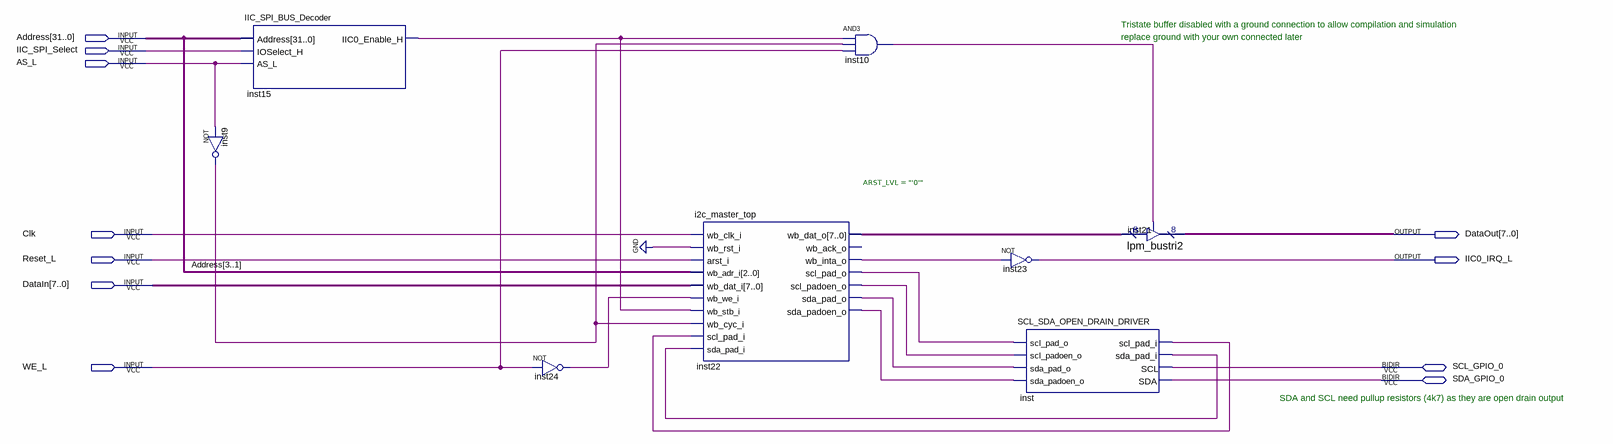
[diagram p0: schematic sheet]
// Quartus schematic IIC_SPI_Interface.bdf as structural Verilog: 8 symbols, 11 pins
module IIC_SPI_Interface (
  input  [31:0] Address,
  input  IIC_SPI_Select,
  input  AS_L,
  input  Clk,
  input  Reset_L,
  input  [7:0] DataIn,
  input  WE_L,
  inout  SCL_GPIO_0,
  inout  SDA_GPIO_0,
  output [7:0] DataOut,
  output IIC0_IRQ_L
);

  wire inst9_out, inst10_out, inst15_iic0_enable_h, inst22_scl_pad_o, inst22_scl_padoen_o, inst22_sda_pad_o,
       inst22_sda_padoen_o, inst22_wb_inta_o, inst24_out, inst_scl_pad_i, inst_sda_pad_i;
  wire [7:0] inst22_wb_dat_o;

  not inst9 (inst9_out, AS_L);
  IIC_SPI_BUS_Decoder inst15 (
    .Address(Address), .IOSelect_H(IIC_SPI_Select), .AS_L(AS_L), .IIC0_Enable_H(inst15_iic0_enable_h));
  not inst24 (inst24_out, WE_L);
  i2c_master_top #(.ARST_LVL("'0'")) inst22 (
    .wb_clk_i(Clk), .wb_rst_i(1'b0), .arst_i(Reset_L), .wb_adr_i(Address[3:1]), .wb_dat_i(DataIn),
    .wb_we_i(inst24_out), .wb_stb_i(inst15_iic0_enable_h), .wb_cyc_i(inst9_out), .scl_pad_i(inst_scl_pad_i),
    .sda_pad_i(inst_sda_pad_i), .wb_dat_o(inst22_wb_dat_o), .wb_inta_o(inst22_wb_inta_o),
    .scl_pad_o(inst22_scl_pad_o), .scl_padoen_o(inst22_scl_padoen_o), .sda_pad_o(inst22_sda_pad_o),
    .sda_padoen_o(inst22_sda_padoen_o));  // open: wb_ack_o
  and inst10 (inst10_out, inst15_iic0_enable_h, inst9_out, WE_L);
  not inst23 (IIC0_IRQ_L, inst22_wb_inta_o);
  SCL_SDA_OPEN_DRAIN_DRIVER inst (
    .scl_pad_o(inst22_scl_pad_o), .scl_padoen_o(inst22_scl_padoen_o), .sda_pad_o(inst22_sda_pad_o),
    .sda_padoen_o(inst22_sda_padoen_o), .scl_pad_i(inst_scl_pad_i), .sda_pad_i(inst_sda_pad_i),
    .SCL(SCL_GPIO_0), .SDA(SDA_GPIO_0));
  lpm_bustri2 inst21 (.enabledt(inst10_out), .data(inst22_wb_dat_o), .tridata(DataOut));

  // Notes on the sheet:
  //   Tristate buffer disabled with a ground connection to allow compilation and simulation
  //   replace ground with your own connected later
  //   SDA and SCL need pullup resistors (4k7) as they are open drain output
endmodule
